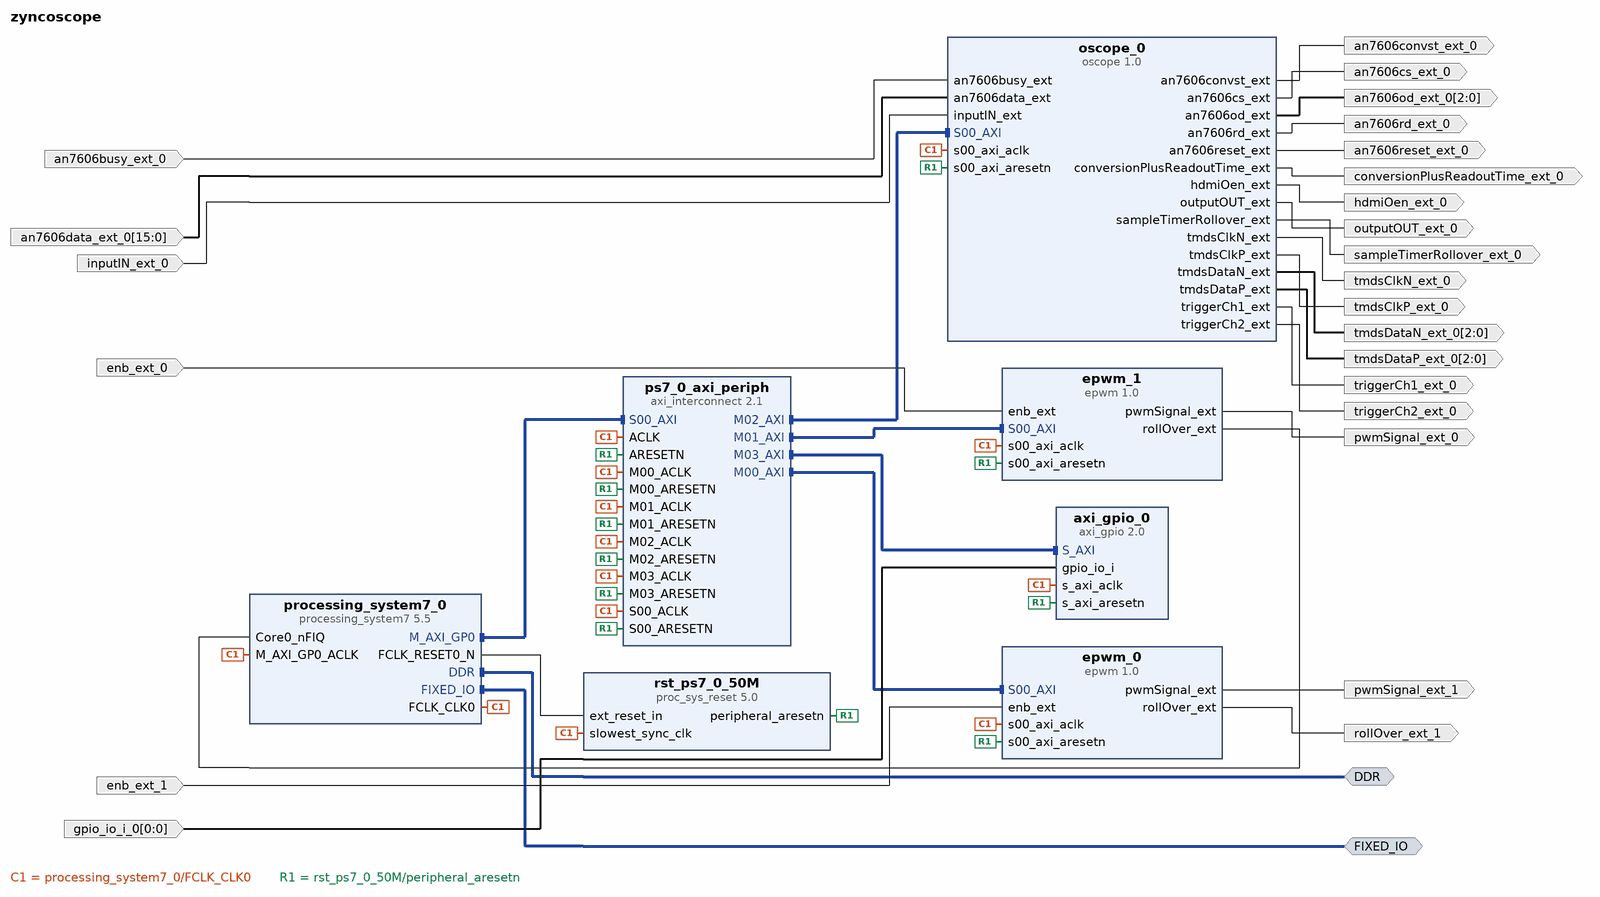
[diagram p0: block diagram of the top level]
# Vivado block design zyncoscope, xc7z010clg400-1, Vivado 2023.1
create_bd_design zyncoscope

create_bd_intf_port -mode Master -vlnv xilinx.com:interface:ddrx_rtl:1.0 DDR
create_bd_intf_port -mode Master -vlnv xilinx.com:display_processing_system7:fixedio_rtl:1.0 FIXED_IO
create_bd_port -dir I enb_ext_0
create_bd_port -dir O pwmSignal_ext_0
create_bd_port -dir O pwmSignal_ext_1
create_bd_port -dir I -from 15 -to 0 an7606data_ext_0
create_bd_port -dir I an7606busy_ext_0
create_bd_port -dir O conversionPlusReadoutTime_ext_0
create_bd_port -dir O sampleTimerRollover_ext_0
create_bd_port -dir O triggerCh1_ext_0
create_bd_port -dir O triggerCh2_ext_0
create_bd_port -dir O an7606convst_ext_0
create_bd_port -dir O an7606cs_ext_0
create_bd_port -dir O an7606reset_ext_0
create_bd_port -dir O -from 2 -to 0 an7606od_ext_0
create_bd_port -dir O -from 2 -to 0 tmdsDataP_ext_0
create_bd_port -dir O -from 2 -to 0 tmdsDataN_ext_0
create_bd_port -dir O tmdsClkP_ext_0
create_bd_port -dir O tmdsClkN_ext_0
create_bd_port -dir O hdmiOen_ext_0
create_bd_port -dir O rollOver_ext_1
create_bd_port -dir I enb_ext_1
create_bd_port -dir O an7606rd_ext_0
create_bd_port -dir I -from 0 -to 0 gpio_io_i_0
create_bd_port -dir O outputOUT_ext_0
create_bd_port -dir I inputIN_ext_0

create_bd_cell -type ip -vlnv xilinx.com:ip:processing_system7:5.5 processing_system7_0
set_property -dict [list \
  CONFIG.PCW_CORE0_FIQ_INTR 1 \
  CONFIG.PCW_GPIO_MIO_GPIO_ENABLE 1 \
  CONFIG.PCW_GPIO_MIO_GPIO_IO MIO \
  CONFIG.PCW_I2C_RESET_ENABLE 0 \
  CONFIG.PCW_PRESET_BANK1_VOLTAGE {LVCMOS 1.8V} \
  CONFIG.PCW_TTC0_PERIPHERAL_ENABLE 1 \
  CONFIG.PCW_TTC0_TTC0_IO EMIO \
  CONFIG.PCW_UART1_PERIPHERAL_ENABLE 1 \
  CONFIG.PCW_UART1_UART1_IO {MIO 48 .. 49} \
  CONFIG.PCW_UART_PERIPHERAL_FREQMHZ 100 \
  CONFIG.PCW_UIPARAM_DDR_PARTNO {MT41J128M16 HA-125} \
  CONFIG.PCW_USB_RESET_ENABLE 0 \
  CONFIG.PCW_USE_FABRIC_INTERRUPT 1 \
] [get_bd_cells processing_system7_0]
# 197 more settings of processing_system7_0 are not shown: defaults, MIO pin electricals, DDR timing, and values the tool derives
create_bd_cell -type ip -vlnv xilinx.com:user:epwm:1.0 epwm_0
create_bd_cell -type ip -vlnv xilinx.com:user:epwm:1.0 epwm_1
create_bd_cell -type ip -vlnv xilinx.com:ip:axi_interconnect:2.1 ps7_0_axi_periph
set_property -dict {CONFIG.NUM_MI 4} [get_bd_cells ps7_0_axi_periph]
create_bd_cell -type ip -vlnv xilinx.com:ip:proc_sys_reset:5.0 rst_ps7_0_50M
create_bd_cell -type ip -vlnv xilinx.com:ip:axi_gpio:2.0 axi_gpio_0
set_property -dict {CONFIG.C_ALL_INPUTS 1 CONFIG.C_GPIO_WIDTH 1 CONFIG.C_IS_DUAL 0} [get_bd_cells axi_gpio_0]
create_bd_cell -type ip -vlnv xilinx.com:user:oscope:1.0 oscope_0

# ---- connections ----

connect_bd_intf_net [get_bd_intf_ports DDR] [get_bd_intf_pins processing_system7_0/DDR]
connect_bd_intf_net [get_bd_intf_ports FIXED_IO] [get_bd_intf_pins processing_system7_0/FIXED_IO]
connect_bd_intf_net [get_bd_intf_pins processing_system7_0/M_AXI_GP0] [get_bd_intf_pins ps7_0_axi_periph/S00_AXI]
connect_bd_intf_net [get_bd_intf_pins ps7_0_axi_periph/M00_AXI] [get_bd_intf_pins epwm_0/S00_AXI]
connect_bd_intf_net [get_bd_intf_pins ps7_0_axi_periph/M01_AXI] [get_bd_intf_pins epwm_1/S00_AXI]
connect_bd_intf_net [get_bd_intf_pins ps7_0_axi_periph/M02_AXI] [get_bd_intf_pins oscope_0/S00_AXI]
connect_bd_intf_net [get_bd_intf_pins ps7_0_axi_periph/M03_AXI] [get_bd_intf_pins axi_gpio_0/S_AXI]
connect_bd_net -net an7606busy_ext_0_1 [get_bd_ports an7606busy_ext_0] [get_bd_pins oscope_0/an7606busy_ext]
connect_bd_net -net an7606data_ext_0_1 [get_bd_ports an7606data_ext_0] [get_bd_pins oscope_0/an7606data_ext]
connect_bd_net -net enb_ext_0_1 [get_bd_ports enb_ext_0] [get_bd_pins epwm_1/enb_ext]
connect_bd_net -net enb_ext_1_1 [get_bd_ports enb_ext_1] [get_bd_pins epwm_0/enb_ext]
connect_bd_net [get_bd_pins epwm_0/pwmSignal_ext] [get_bd_ports pwmSignal_ext_1]
connect_bd_net [get_bd_pins epwm_0/rollOver_ext] [get_bd_ports rollOver_ext_1]
connect_bd_net [get_bd_pins epwm_1/pwmSignal_ext] [get_bd_ports pwmSignal_ext_0]
connect_bd_net [get_bd_pins epwm_1/rollOver_ext] [get_bd_pins processing_system7_0/Core0_nFIQ]
connect_bd_net -net gpio_io_i_0_1 [get_bd_ports gpio_io_i_0] [get_bd_pins axi_gpio_0/gpio_io_i]
connect_bd_net -net inputIN_ext_0_1 [get_bd_ports inputIN_ext_0] [get_bd_pins oscope_0/inputIN_ext]
connect_bd_net [get_bd_pins oscope_0/an7606convst_ext] [get_bd_ports an7606convst_ext_0]
connect_bd_net [get_bd_pins oscope_0/an7606cs_ext] [get_bd_ports an7606cs_ext_0]
connect_bd_net [get_bd_pins oscope_0/an7606od_ext] [get_bd_ports an7606od_ext_0]
connect_bd_net [get_bd_pins oscope_0/an7606rd_ext] [get_bd_ports an7606rd_ext_0]
connect_bd_net [get_bd_pins oscope_0/an7606reset_ext] [get_bd_ports an7606reset_ext_0]
connect_bd_net [get_bd_pins oscope_0/conversionPlusReadoutTime_ext] [get_bd_ports conversionPlusReadoutTime_ext_0]
connect_bd_net [get_bd_pins oscope_0/hdmiOen_ext] [get_bd_ports hdmiOen_ext_0]
connect_bd_net [get_bd_pins oscope_0/outputOUT_ext] [get_bd_ports outputOUT_ext_0]
connect_bd_net [get_bd_pins oscope_0/sampleTimerRollover_ext] [get_bd_ports sampleTimerRollover_ext_0]
connect_bd_net [get_bd_pins oscope_0/tmdsClkN_ext] [get_bd_ports tmdsClkN_ext_0]
connect_bd_net [get_bd_pins oscope_0/tmdsClkP_ext] [get_bd_ports tmdsClkP_ext_0]
connect_bd_net [get_bd_pins oscope_0/tmdsDataN_ext] [get_bd_ports tmdsDataN_ext_0]
connect_bd_net [get_bd_pins oscope_0/tmdsDataP_ext] [get_bd_ports tmdsDataP_ext_0]
connect_bd_net [get_bd_pins oscope_0/triggerCh1_ext] [get_bd_ports triggerCh1_ext_0]
connect_bd_net [get_bd_pins oscope_0/triggerCh2_ext] [get_bd_ports triggerCh2_ext_0]
connect_bd_net [get_bd_pins processing_system7_0/FCLK_CLK0] \
  [get_bd_pins processing_system7_0/M_AXI_GP0_ACLK] [get_bd_pins ps7_0_axi_periph/S00_ACLK] \
  [get_bd_pins rst_ps7_0_50M/slowest_sync_clk] [get_bd_pins epwm_0/s00_axi_aclk] [get_bd_pins ps7_0_axi_periph/M00_ACLK] \
  [get_bd_pins ps7_0_axi_periph/ACLK] [get_bd_pins epwm_1/s00_axi_aclk] [get_bd_pins ps7_0_axi_periph/M01_ACLK] \
  [get_bd_pins ps7_0_axi_periph/M02_ACLK] [get_bd_pins ps7_0_axi_periph/M03_ACLK] [get_bd_pins axi_gpio_0/s_axi_aclk] \
  [get_bd_pins oscope_0/s00_axi_aclk]
connect_bd_net [get_bd_pins processing_system7_0/FCLK_RESET0_N] [get_bd_pins rst_ps7_0_50M/ext_reset_in]
connect_bd_net [get_bd_pins rst_ps7_0_50M/peripheral_aresetn] \
  [get_bd_pins ps7_0_axi_periph/S00_ARESETN] [get_bd_pins epwm_0/s00_axi_aresetn] [get_bd_pins ps7_0_axi_periph/M00_ARESETN] \
  [get_bd_pins ps7_0_axi_periph/ARESETN] [get_bd_pins epwm_1/s00_axi_aresetn] [get_bd_pins ps7_0_axi_periph/M01_ARESETN] \
  [get_bd_pins ps7_0_axi_periph/M02_ARESETN] [get_bd_pins ps7_0_axi_periph/M03_ARESETN] \
  [get_bd_pins axi_gpio_0/s_axi_aresetn] [get_bd_pins oscope_0/s00_axi_aresetn]

# ---- address map ----
assign_bd_address -offset 0x41200000 -range 64K -target_address_space [get_bd_addr_spaces processing_system7_0/Data] [get_bd_addr_segs axi_gpio_0/S_AXI/Reg]
assign_bd_address -offset 0x43C00000 -range 64K -target_address_space [get_bd_addr_spaces processing_system7_0/Data] [get_bd_addr_segs epwm_0/S00_AXI/S00_AXI_reg]
assign_bd_address -offset 0x43C10000 -range 64K -target_address_space [get_bd_addr_spaces processing_system7_0/Data] [get_bd_addr_segs epwm_1/S00_AXI/S00_AXI_reg]
assign_bd_address -offset 0x43C20000 -range 64K -target_address_space [get_bd_addr_spaces processing_system7_0/Data] [get_bd_addr_segs oscope_0/S00_AXI/S00_AXI_reg]

validate_bd_design
save_bd_design
